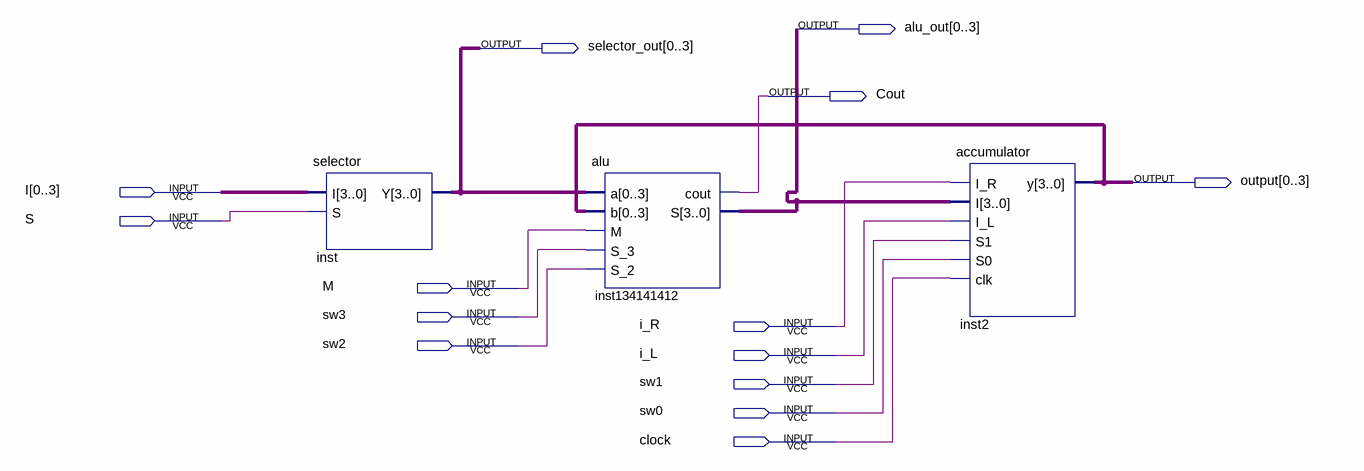
[diagram p0: schematic sheet]
// Quartus schematic lab10.bdf as structural Verilog: 3 symbols, 14 pins
module lab10 (
  input  [0:3] I,
  input  S,
  input  M,
  input  sw3,
  input  i_R,
  input  sw2,
  input  i_L,
  input  sw1,
  input  sw0,
  input  clock,
  output [0:3] alu_out,
  output [0:3] selector_out,
  output Cout,
  output [0:3] \output 
);

  selector inst (.I(I), .S(S), .Y(selector_out));
  alu inst134141412 (.a(selector_out), .b(\output ), .M(M), .S_3(sw3), .S_2(sw2), .cout(Cout), .S(alu_out));
  accumulator inst2 (.I_R(i_R), .I(alu_out), .I_L(i_L), .S1(sw1), .S0(sw0), .clk(clock), .y(\output ));
endmodule
